# Altium project V1.00.PrjPcb
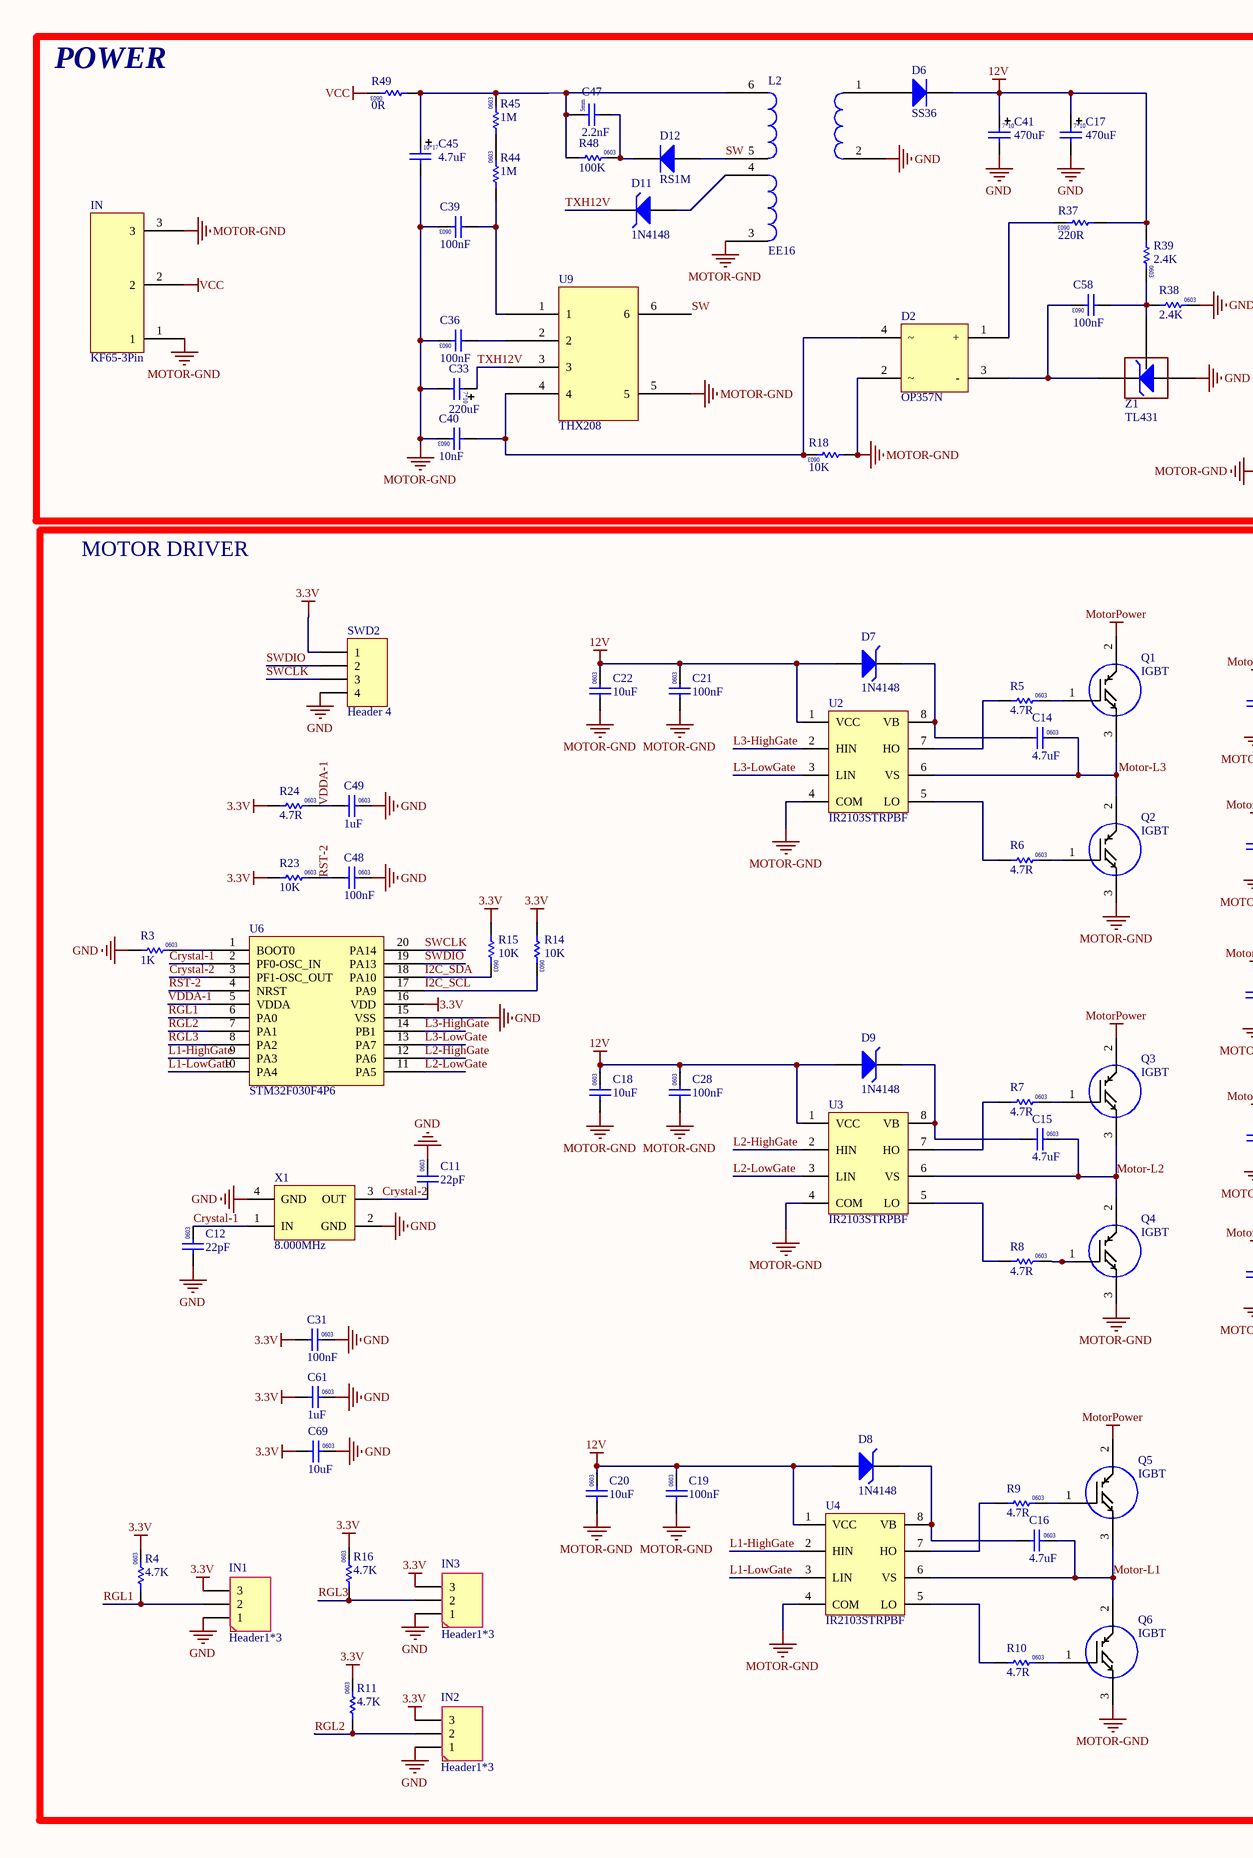
[diagram p0: Sheet1.SchDoc, left]
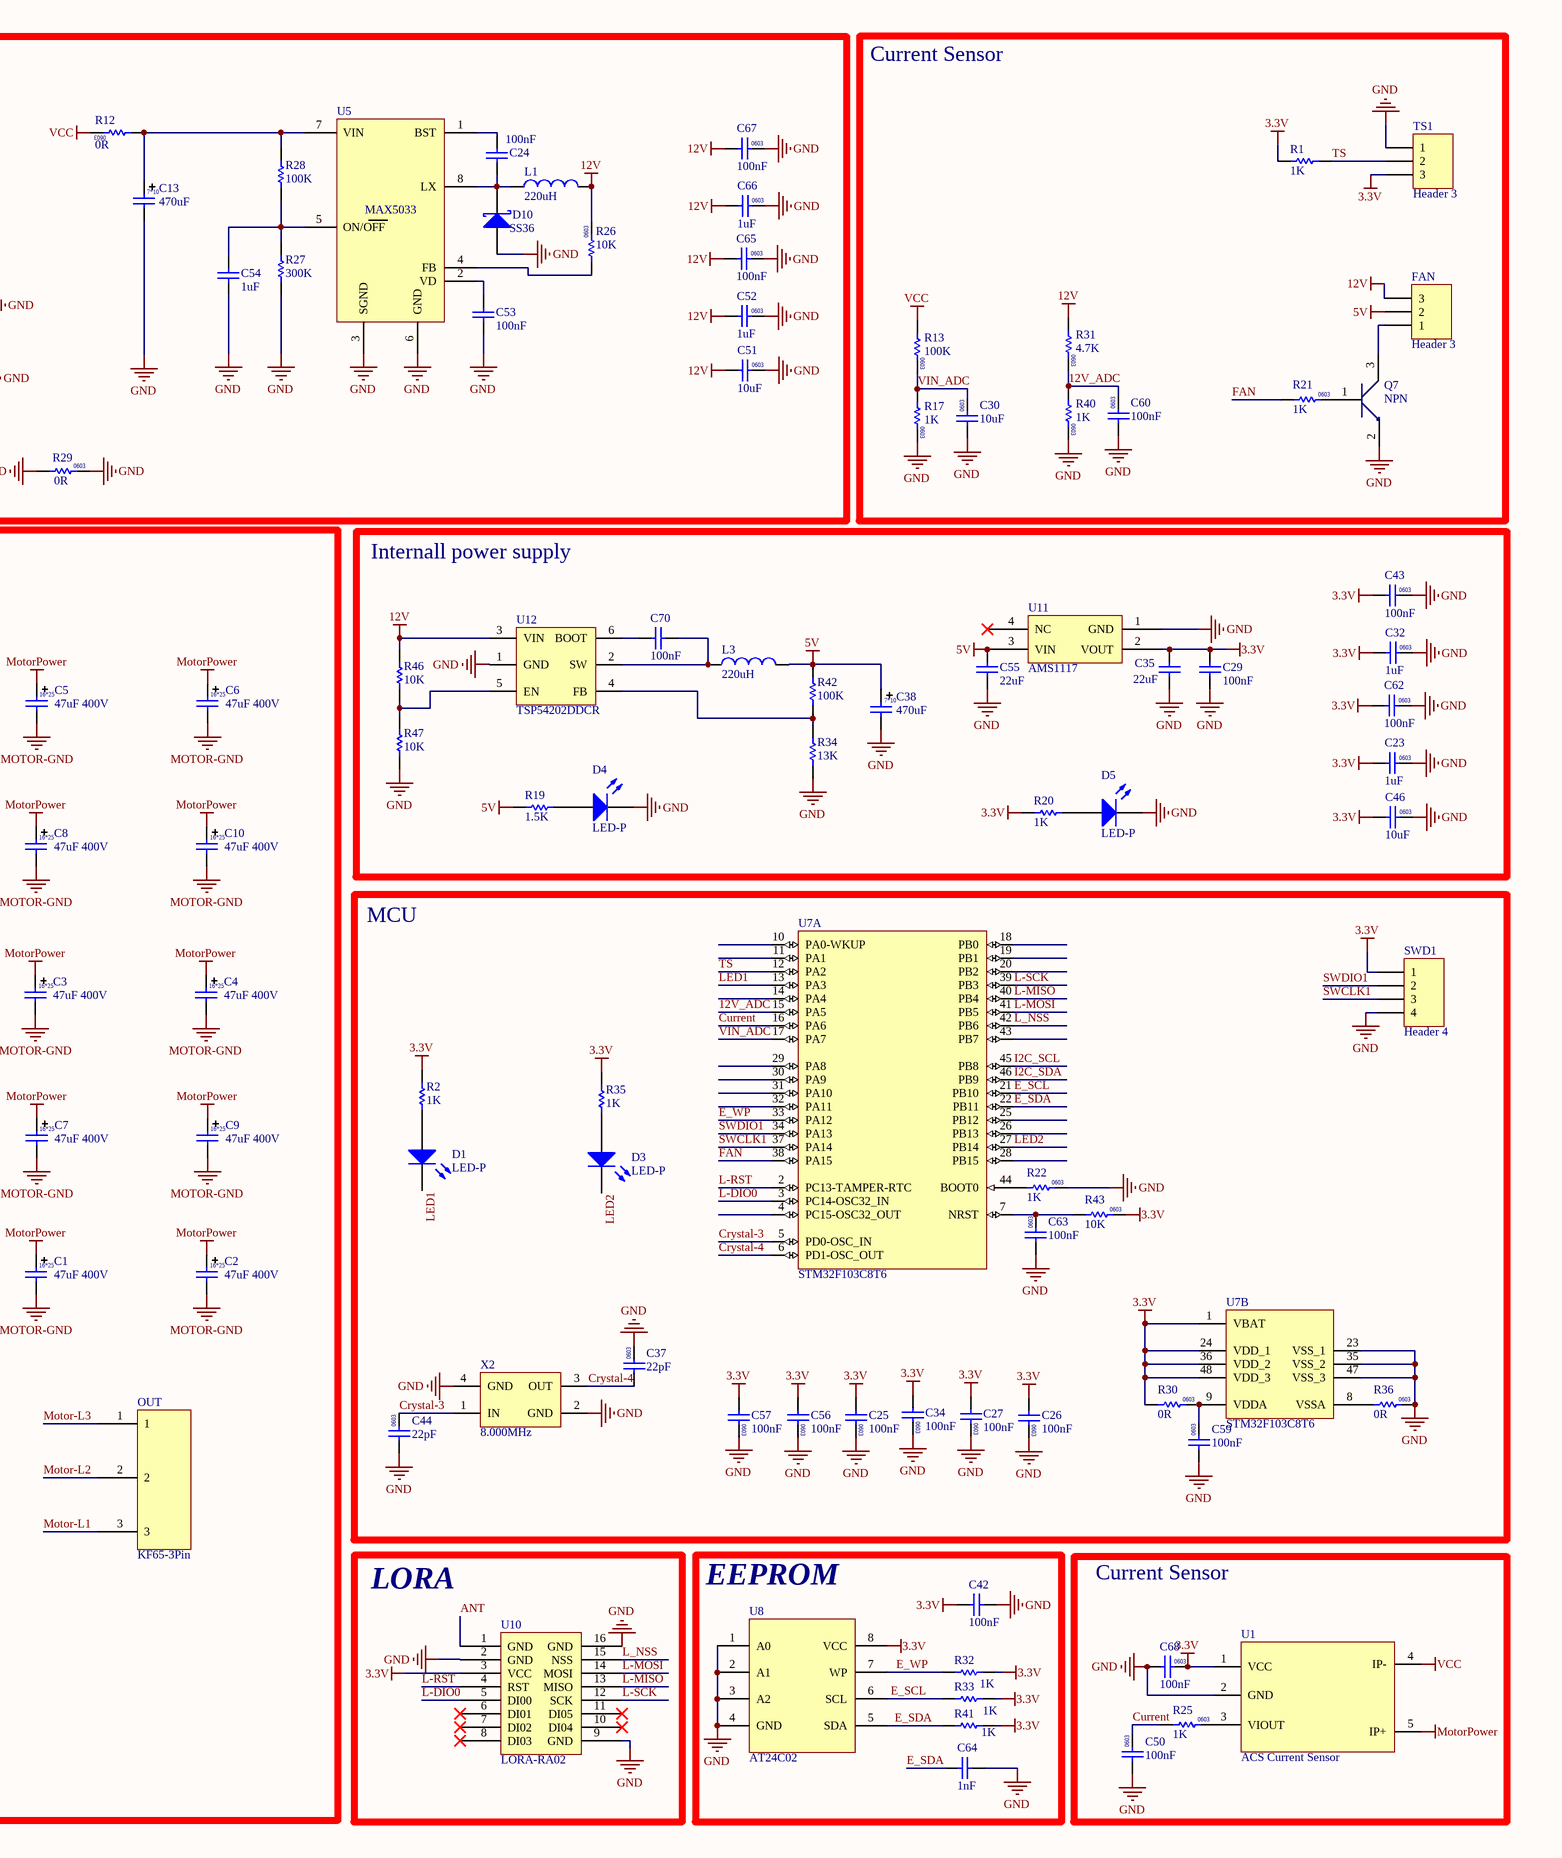
[diagram p1: Sheet1.SchDoc, right]
1 sheet, 165 parts. Net scope: global (net labels, ports and power ports of the same name join across sheets).
Board file: 3PHASE.PcbDoc

## Sheet Sheet1.SchDoc
size 524 x 374 mm

### Parts
C1  47uF 400V  [CAP 16*25]
C2  47uF 400V  [CAP 16*25]
C3  47uF 400V  [CAP 16*25]
C4  47uF 400V  [CAP 16*25]
C5  47uF 400V  [CAP 16*25]
C6  47uF 400V  [CAP 16*25]
C7  47uF 400V  [CAP 16*25]
C8  47uF 400V  [CAP 16*25]
C9  47uF 400V  [CAP 16*25]
C10  47uF 400V  [CAP 16*25]
C11  22pF  [CAP0603]
C12  22pF  [CAP0603]
C13  470uF  [CAP 7*10]
C14  4.7uF  [CAP0603]
C15  4.7uF  [CAP0603]
C16  4.7uF  [CAP0603]
C17  470uF  [CAP 7*10]
C18  10uF  [CAP0603]
C19  100nF  [CAP0603]
C20  10uF  [CAP0603]
C21  100nF  [CAP0603]
C22  10uF  [CAP0603]
C23  1uF  [CAP0603]
C24  100nF  [CAPC0603]
C25  100nF  [CAP0603]
C26  100nF  [CAP0603]
C27  100nF  [CAP0603]
C28  100nF  [CAP0603]
C29  100nF  [CAPC0603]
C30  10uF  [CAP0603]
C31  100nF  [CAP0603]
C32  1uF  [CAP0603]
C33  220uF  [CAP 7*10]
C34  100nF  [CAP0603]
C35  22uF  [CAPC0603]
C36  100nF  [CAP0603]
C37  22pF  [CAP0603]
C38  470uF  [CAP 7*10]
C39  100nF  [CAP0603]
C40  10nF  [CAP0603]
C41  470uF  [CAP 7*10]
C42  100nF  [CAPC0603]
C43  100nF  [CAP0603]
C44  22pF  [CAP0603]
C45  4.7uF  [CAP 10*17]
C46  10uF  [CAP0603]
C47  2.2nF  [CAP CERAMIC]
C48  100nF  [CAP0603]
C49  1uF  [CAP0603]
C50  100nF  [CAP0603]
C51  10uF  [CAP0603]
C52  1uF  [CAP0603]
C53  100nF  [CAPC0603]
C54  1uF  [CAPC0603]
C55  22uF  [CAPC0603]
C56  100nF  [CAP0603]
C57  100nF  [CAP0603]
C58  100nF  [CAP0603]
C59  100nF  [CAP0603]
C60  100nF  [CAP0603]
C61  1uF  [CAP0603]
C62  100nF  [CAP0603]
C63  100nF  [CAP0603]
C64  1nF  [CAPC0603]
C65  100nF  [CAP0603]
C66  1uF  [CAP0603]
C67  100nF  [CAP0603]
C68  100nF  [CAP0603]
C69  10uF  [CAP0603]
C70  100nF  [CAPC0603]
D1  LED-P  [LED]
D2  OP357N  [MB10F]
D3  LED-P  [LED]
D4  LED-P  [LED]
D5  LED-P  [LED]
D6  SS36  [SS36]
D7  1N4148  [ZENER]
D8  1N4148  [ZENER]
D9  1N4148  [ZENER]
D10  SS36  [SS36]
D11  1N4148  [ZENER]
D12  RS1M  [SS36]
FAN  Header 3  [Header1*3]
IN  KF65-3Pin  [KF65-3Pin]
IN1  Header1*3  [HEADER1*3]
IN2  Header1*3  [HEADER1*3]
IN3  Header1*3  [HEADER1*3]
L1  220uH  [L100uH-SMD-1A]
L2  EE16  [EE16]
L3  220uH  [L100uH-SMD-1A]
OUT  KF65-3Pin  [KF65-3Pin]
Q1  IGBT  [IGBT TO-247]
Q2  IGBT  [IGBT TO-247]
Q3  IGBT  [IGBT TO-247]
Q4  IGBT  [IGBT TO-247]
Q5  IGBT  [IGBT TO-247]
Q6  IGBT  [IGBT TO-247]
Q7  NPN  [BC817]
R1  1K  [RESC0603]
R2  1K  [RESC0603]
R3  1K  [RES0603]
R4  4.7K  [RES0603]
R5  4.7R  [RES0603]
R6  4.7R  [RES0603]
R7  4.7R  [RES0603]
R8  4.7R  [RES0603]
R9  4.7R  [RES0603]
R10  4.7R  [RES0603]
R11  4.7K  [RES0603]
R12  0R  [RES0603]
R13  100K  [RES0603]
R14  10K  [RES0603]
R15  10K  [RES0603]
R16  4.7K  [RES0603]
R17  1K  [RES0603]
R18  10K  [RES0603]
R19  1.5K  [RESC0603]
R20  1K  [RESC0603]
R21  1K  [RES0603]
R22  1K  [RES0603]
R23  10K  [RES0603]
R24  4.7R  [RES0603]
R25  1K  [RES0603]
R26  10K  [RES0603]
R27  300K  [RESC0603]
R28  100K  [RESC0603]
R29  0R  [RES0603]
R30  0R  [RES0603]
R31  4.7K  [RES0603]
R32  1K  [RESC0603]
R33  1K  [RESC0603]
R34  13K  [RESC0603]
R35  1K  [RESC0603]
R36  0R  [RES0603]
R37  220R  [RES0603]
R38  2.4K  [RES0603]
R39  2.4K  [RES0603]
R40  1K  [RES0603]
R41  1K  [RESC0603]
R42  100K  [RESC0603]
R43  10K  [RES0603]
R44  1M  [RES0603]
R45  1M  [RES0603]
R46  10K  [RESC0603]
R47  10K  [RESC0603]
R48  100K  [RES0603]
R49  0R  [RES0603]
SWD1  Header 4  [PIN HEADER 1*4 MALE]
SWD2  Header 4  [PIN HEADER 1*4 MALE]
TS1  Header 3  [Header1*3]
U1  ACS Current Sensor  [ACS Current Sensor]
U2  IR2103STRPBF  [IR2103STRBF]
U3  IR2103STRPBF  [IR2103STRBF]
U4  IR2103STRPBF  [IR2103STRBF]
U5  MAX5033  [AT24C02]
U6  STM32F030F4P6  [STM32F030F4P6]
U7  STM32F103C8T6  [STM32F103C8T6]  (parts A,B of 2)
U8  AT24C02  [AT24C02]
U9  THX208  [THX208]
U10  LORA-RA02  [LORA-RA02]
U11  AMS1117  [AMS1117]
U12  TSP54202DDCR  [PRTR5]
X1  8.000MHz  [CRYSTAL_SMD4PIN]
X2  8.000MHz  [CRYSTAL_SMD4PIN]
Z1  TL431  [TL431]

### Blocks framed on the sheet
POWER: C13 C17 C24 C33 C36 C39-C41 C45 C47 C51-C54 C58 C65-C67 D2 D6 D10-D12 IN L1 L2 R12 R18 R26-R29 R37-R39 R44 R45 R48 R49 U5 U9 Z1
Current Sensor: C30 C60 FAN Q7 R1 R13 R17 R21 R31 R40 TS1
MOTOR DRIVER: C1-C12 C14-C16 C18-C22 C28 C31 C48 C49 C61 C69 D7-D9 IN1-IN3 OUT Q1-Q6 R3-R11 R14-R16 R23 R24 SWD2 U2-U4 U6 X1
Internall power supply: C23 C29 C32 C35 C38 C43 C46 C55 C62 C70 D4 D5 L3 R19 R20 R34 R42 R46 R47 U11 U12
MCU: C25-C27 C34 C37 C44 C56 C57 C59 C63 D1 D3 R2 R22 R30 R35 R36 R43 SWD1 U7 X2
LORA: U10
EEPROM: C42 C64 R32 R33 R41 U8
Current Sensor: C50 C68 R25 U1

### Nets
3.3V: C23.1 C25.1 C26.1 C27.1 C29.2 C31.1 C32.1 C34.1 C35.2 C42.2 C43.1 C46.1 C56.1 C57.1 C61.1 C62.1 C68.2 C69.1 IN1.3 IN2.3 IN3.3 R1.2 R2.1 R4.2 R11.2 R14.1 R15.1 R16.2 R20.1 R23.1 R24.1 R30.1 R32.2 R33.2 R35.1 R41.2 R43.2 SWD1.1 SWD2.1 TS1.3 U1.1(VCC) U6.16(VDD) U7.1(VBAT) U7.24(VDD_1) U7.36(VDD_2) U7.48(VDD_3) U8.8(VCC) U10.3(VCC) U11.2(VOUT)
5V: C38.1 C55.2 FAN.2 L3.2 R19.1 R42.1 U11.3(VIN)
12V: C17.1 C18.2 C19.2 C20.2 C21.2 C22.2 C28.2 C41.1 C51.1 C52.1 C65.1 C66.1 C67.1 D6.2(K) D7.1(A) D8.1(A) D9.1(A) FAN.3 L1.2 R26.2 R31.1 R37.1 R39.1 R46.2 U2.1(VCC) U3.1(VCC) U4.1(VCC) U12.3(VIN)
GND: C11.2 C12.1 C13.2 C17.2 C23.2 C25.2 C26.2 C27.2 C29.1 C30.1 C31.2 C32.2 C34.2 C35.1 C37.2 C38.2 C41.2 C42.1 C43.2 C44.1 C46.2 C48.2 C49.2 C50.1 C51.2 C52.2 C53.1 C54.1 C55.1 C56.2 C57.2 C59.1 C60.1 C61.2 C62.2 C63.1 C64.2 C65.2 C66.2 C67.2 C68.1 C69.2 D4.2(K) D5.2(K) D10.1(A) IN1.1 IN2.1 IN3.1 L2.2 Q7.2(E) R3.1 R17.2 R22.2 R27.1 R29.2 R34.1 R36.2 R38.2 R40.2 R47.1 SWD1.4 SWD2.4 TS1.1 U1.2(GND) U5.3(SGND) U5.6(GND) U6.15(VSS) U7.23(VSS_1) U7.35(VSS_2) U7.47(VSS_3) U8.1(A0) U8.2(A1) U8.3(A2) U8.4(GND) U10.2(GND) U10.9(GND) U10.16(GND) U11.1(GND) U12.1(GND) X1.2(GND) X1.4(GND) X2.2(GND) X2.4(GND) Z1.3(A)
MOTOR-GND: C1.1 C2.1 C3.1 C4.1 C5.1 C6.1 C7.1 C8.1 C9.1 C10.1 C18.1 C19.1 C20.1 C21.1 C22.1 C28.1 C33.2 C36.2 C39.2 C40.2 C45.2 D2.2 IN.1 IN.3 L2.3 Q2.3 Q4.3 Q6.3 R18.1 R29.1 U2.4(COM) U3.4(COM) U4.4(COM) U9.5
MotorPower: C1.2 C2.2 C3.2 C4.2 C5.2 C6.2 C7.2 C8.2 C9.2 C10.2 Q1.2 Q3.2 Q5.2 U1.5(IP+)
VCC: IN.2 R12.2 R13.1 R49.2 U1.4(IP-)
12V_ADC: C60.2 R31.2 R40.1 U7.15(PA5)
ANT: U10.1(GND)
Crystal-1: C12.2 U6.2(PF0-OSC_IN) X1.1(IN)
Crystal-2: C11.1 U6.3(PF1-OSC_OUT) X1.3(OUT)
Crystal-3: C44.2 U7.5(PD0-OSC_IN) X2.1(IN)
Crystal-4: C37.1 U7.6(PD1-OSC_OUT) X2.3(OUT)
Current: C50.2 R25.1 U7.16(PA6)
E_SCL: R33.1 U7.21(PB10) U8.6(SCL)
E_SDA: C64.1 R41.1 U7.22(PB11) U8.5(SDA)
E_WP: R32.1 U7.33(PA12) U8.7(WP)
FAN: R21.1 U7.38(PA15)
I2C_SCL: R14.2 U6.17(PA9) U7.45(PB8)
I2C_SDA: R15.2 U6.18(PA10) U7.46(PB9)
L1-HighGate: U4.2(HIN) U6.9(PA3)
L1-LowGate: U4.3(LIN) U6.10(PA4)
L2-HighGate: U3.2(HIN) U6.12(PA6)
L2-LowGate: U3.3(LIN) U6.11(PA5)
L3-HighGate: U2.2(HIN) U6.14(PB1)
L3-LowGate: U2.3(LIN) U6.13(PA7)
L-DIO0: U7.3(PC14-OSC32_IN) U10.5(DI00)
L-MISO: U7.40(PB4) U10.13(MISO)
L-MOSI: U7.41(PB5) U10.14(MOSI)
L-RST: U7.2(PC13-TAMPER-RTC) U10.4(RST)
L-SCK: U7.39(PB3) U10.12(SCK)
L_NSS: U7.42(PB6) U10.15(NSS)
LED1: D1.2(K) U7.13(PA3)
LED2: D3.2(K) U7.27(PB14)
Motor-L1: C16.2 OUT.3 Q5.3 Q6.2 U4.6(VS)
Motor-L2: C15.2 OUT.2 Q3.3 Q4.2 U3.6(VS)
Motor-L3: C14.2 OUT.1 Q1.3 Q2.2 U2.6(VS)
RGL1: IN1.2 R4.1 U6.6(PA0)
RGL2: IN2.2 R11.1 U6.7(PA1)
RGL3: IN3.2 R16.1 U6.8(PA2)
RST-2: C48.1 R23.2 U6.4(NRST)
SW: D12.1(A) L2.5 U9.6
SWCLK: SWD2.3 U6.20(PA14)
SWCLK1: SWD1.3 U7.37(PA14)
SWDIO: SWD2.2 U6.19(PA13)
SWDIO1: SWD1.2 U7.34(PA13)
TS: R1.1 TS1.2 U7.12(PA2)
TXH12V: C33.1 D11.2(K) U9.3
VDDA-1: C49.1 R24.2 U6.5(VDDA)
VIN_ADC: C30.2 R13.2 R17.1 U7.17(PA7)
NetC13_1: C13.1 R12.1 R28.2 U5.7(VIN)
NetC14_1: C14.1 D7.2(K) U2.8(VB)
NetC15_1: C15.1 D9.2(K) U3.8(VB)
NetC16_1: C16.1 D8.2(K) U4.8(VB)
NetC24_1: C24.1 D10.2(K) L1.1 U5.8(LX)
NetC24_2: C24.2 U5.1(BST)
NetC36_1: C36.1 U9.2
NetC39_1: C39.1 R44.1 U9.1
NetC40_1: C40.1 D2.4 R18.2 U9.4
NetC45_1: C45.1 C47.1 L2.6 R45.2 R48.1 R49.1
NetC47_2: C47.2 D12.2(K) R48.2
NetC53_2: C53.2 U5.2(VD)
NetC54_2: C54.2 R27.2 R28.1 U5.5(ON/OFF)
NetC58_1: C58.1 R38.1 R39.2 Z1.2
NetC58_2: C58.2 D2.3(-) Z1.1(K)
NetC59_2: C59.2 R30.2 U7.9(VDDA)
NetC63_2: C63.2 R43.1 U7.7(NRST)
NetC70_1: C70.1 L3.1 U12.2(SW)
NetC70_2: C70.2 U12.6(BOOT)
NetD1_1: D1.1(A) R2.2
NetD2_1: D2.1(+) R37.2
NetD3_1: D3.1(A) R35.2
NetD4_1: D4.1(A) R19.2
NetD5_1: D5.1(A) R20.2
NetD6_1: D6.1(A) L2.1
NetD11_1: D11.1(A) L2.4
NetFAN_1: FAN.1 Q7.3(C)
NetQ1_1: Q1.1 R5.2
NetQ2_1: Q2.1 R6.2
NetQ3_1: Q3.1 R7.2
NetQ4_1: Q4.1 R8.2
NetQ5_1: Q5.1 R9.2
NetQ6_1: Q6.1 R10.2
NetQ7_1: Q7.1(B) R21.2
NetR3_2: R3.2 U6.1(BOOT0)
NetR5_1: R5.1 U2.7(HO)
NetR6_1: R6.1 U2.5(LO)
NetR7_1: R7.1 U3.7(HO)
NetR8_1: R8.1 U3.5(LO)
NetR9_1: R9.1 U4.7(HO)
NetR10_1: R10.1 U4.5(LO)
NetR22_1: R22.1 U7.44(BOOT0)
NetR25_2: R25.2 U1.3(VIOUT)
NetR26_1: R26.1 U5.4(FB)
NetR34_2: R34.2 R42.2 U12.4(FB)
NetR36_1: R36.1 U7.8(VSSA)
NetR44_2: R44.2 R45.1
NetR46_1: R46.1 R47.2 U12.5(EN)

Not connected (* = marked no-connect by the designer): U7 4(PC15-OSC32_OUT) 10(PA0-WKUP) 11(PA1) 14(PA4) 18(PB0) 19(PB1) 20(PB2) 25(PB12) 26(PB13) 28(PB15) 29(PA8) 30(PA9) 31(PA10) 32(PA11) 43(PB7); U10 6(DI01)* 7(DI02)* 8(DI03)* 10(DI04)* 11(DI05)*; U11 4(NC)*

### Notes on the sheet
- (in symbol CAP0603) 0603
- (in symbol CAP 7*10) 7*10
- (in symbol CAP 10*17) 10*17
- (in symbol CAP 16*25) 16*25
- (in symbol CAP CERAMIC) 5mm
- (in symbol RES0603) 0603

### Library data of the parts
C1-C10 = CAP 16*25
C11 C12 C14-C16 C18-C23 C25-C28 C30-C32 C34 C36 C37 C39 C40 C43 C44 C46 C48-C52 C56-C63 C65-C69 = CAP0603
C13 C17 C33 C38 C41 = CAP 7*10
C24 C42 C53 C70 = Capacitor: 100nF-0603; Published: 8-Jun-2000; LatestRevisionDate: 17-Jul-2002; LatestRevisionNote: Re-released for DXP Platform.; PackageReference: C0805; Publisher: Altium Limited; Value: 100nF
C29 = 22uF: 100nF-0603; Published: 8-Jun-2000; LatestRevisionDate: 17-Jul-2002; LatestRevisionNote: Re-released for DXP Platform.; PackageReference: C0805; Publisher: Altium Limited; Value: 100nF
C35 = 22uF: 22uF-0603; Published: 8-Jun-2000; LatestRevisionDate: 17-Jul-2002; LatestRevisionNote: Re-released for DXP Platform.; PackageReference: C0805; Publisher: Altium Limited; Value: 22uF
C45 = CAP 10*17
C47 = CAP CERAMIC
C54 = Capacitor: 1uF-0603; Published: 8-Jun-2000; LatestRevisionDate: 17-Jul-2002; LatestRevisionNote: Re-released for DXP Platform.; PackageReference: C0805; Publisher: Altium Limited; Value: 1uF
C55 = 10uF: 22uF-0603; Published: 8-Jun-2000; LatestRevisionDate: 17-Jul-2002; LatestRevisionNote: Re-released for DXP Platform.; PackageReference: C0805; Publisher: Altium Limited; Value: 22uF
C64 = Capacitor: 10nF-0603; Published: 8-Jun-2000; LatestRevisionDate: 17-Jul-2002; LatestRevisionNote: Re-released for DXP Platform.; PackageReference: C0805; Publisher: Altium Limited; Value: 1nF
D1 D3-D5 = LED: Published: 8-Jun-2000; LatestRevisionDate: 17-Dec-2003; LatestRevisionNote: PCB Footprint replaced.; DatasheetDocument: 16-Apr-2002; PackageDocument: 16-Apr-2002; PackageReference: 3.5X2.8X1.9; Publisher: Altium Limited
D2 = MB10F: optp
D7-D9 D11 = ZENER
D10 = SS34: SS36 -Jled; Published: 8-Jun-2000; LatestRevisionDate: 17-Jul-2002; LatestRevisionNote: Re-released for DXP Platform.; PackageReference: SMB; Publisher: Altium Limited; Code_JEDEC: DO-214-AA
D12 = SS36
FAN TS1 = Header 3: stright, 3-Pin; LatestRevisionDate: 17-Jul-2002; LatestRevisionNote: Re-released for DXP Platform.; Publisher: Altium Limited
IN1-IN3 = Header1*3: Header, 3-Pin; LatestRevisionDate: 17-Jul-2002; LatestRevisionNote: Re-released for DXP Platform.; Publisher: Altium Limited
L1 L3 = L47uH-3A: 220uH-0.5A; Value: 220uH
Q1-Q6 = IGBT TO-247
Q7 = BC817
R1 R2 R19 R20 R32-R35 R41 R42 R46 R47 = Resistor: 1K-0603; Published: 8-Jun-2000; LatestRevisionDate: 17-Jul-2002; LatestRevisionNote: Re-released for DXP Platform.; PackageReference: AXIAL-0.5; Publisher: Altium Limited
  R1 R2 R20 R32 R33 R35 R41: Value: 1K
  R19: Value: 1.5K
  R34: Value: 13K
  R42: Value: 100K
  R46 R47: Value: 10K
R3-R18 R21-R26 R29-R31 R36-R40 R43-R45 R48 R49 = RES0603
R27 = Resistor: 300K-0603; Value: 2.5M; Published: 8-Jun-2000; LatestRevisionDate: 17-Jul-2002; LatestRevisionNote: Re-released for DXP Platform.; PackageReference: AXIAL-0.5; Publisher: Altium Limited
R28 = Resistor: 100K-0603; Value: 866K; Published: 8-Jun-2000; LatestRevisionDate: 17-Jul-2002; LatestRevisionNote: Re-released for DXP Platform.; PackageReference: AXIAL-0.5; Publisher: Altium Limited
SWD1 SWD2 = Header 4: Header, 4-Pin; LatestRevisionDate: 17-Jul-2002; LatestRevisionNote: Re-released for DXP Platform.; Publisher: Altium Limited
U2-U4 = IR1003STRPBF
U5 = MAX5033: High-Efficiency, MAXPower    Step-Down DC-DC Converter
U7 = STM32F103C8T6: ARM Cortex-M3 32-bit MCU, 64 KB Flash, 20 KB Internal RAM, 37 I/Os, 48-pin LQFP, -40 to 85 degC, Tray; A/D Converter: 2x12-bit (10 Channel); FLASH Size (Prog) (kB): 64; I/Os (High Current): 37; Internal RAM Size (kB): 20; Operating Frequency(F) (Processor speed) (MHz): 72; Supply Voltage(Vcc) min (V): 2; DatasheetVersion: Rev. 16; PackageVersion: Rev. 6, 06/2013; PackageReference: LQFP48; PackageDescription: 48-Pin Low Profile Quad Flat Package, 7 x 7 mm Body, 0.5 mm Pitch; Supplier 1: Digi-Key; Supplier Part Number 1: 497-6063-ND; Supplier 2: Farnell; Supplier Part Number 2: 1447637; Supplier 3: Newark; Supplier Part Number 3: 59M2182; Supplier 4: Newark; Supplier Part Number 4: 57P1222; Supplier 5: Mouser; Supplier Part Number 5: 511-STM32F103C8T6; Core: ARM Cortex-M3; Packing: Tray; Mounting Technology: Surface Mount; PartNumber: STM32F103C8T6; ComponentLink1Description: Manufacturer URL; ComponentLink1URL: http://www.st.com/web/en/home.html; ComponentLink2Description: Datasheet; ComponentLink2URL: http://www.st.com/st-web-ui/static/active/en/resource/technical/document/datasheet/CD00161566.pdf; ComponentLink3Description: Package Specification; ComponentLink3URL: http://www.st.com/st-web-ui/static/active/en/resource/technical/document/datasheet/DM00058181.pdf
U8 = AT24C02: EEPROM
U11 = AMS1117: IC REG LIN 3.3V
X1 X2 = CRYSTAL_SMD4PIN